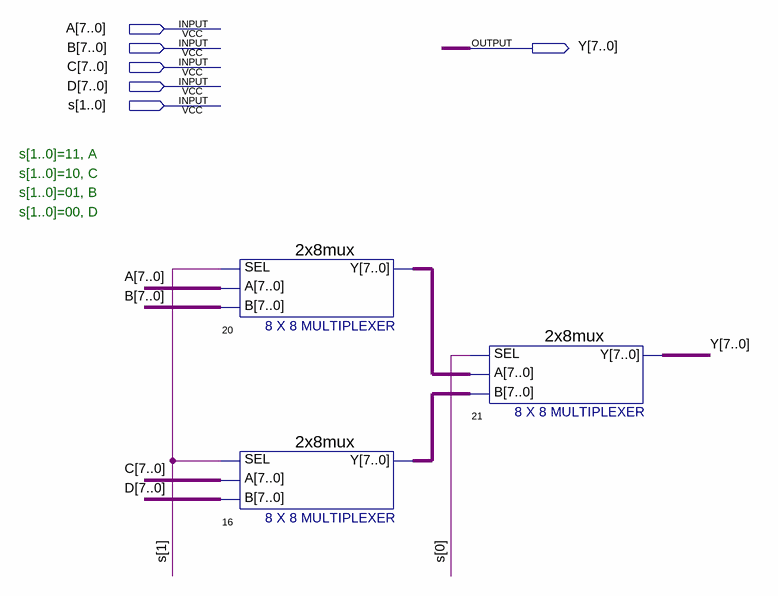
[diagram p0: schematic sheet]
// Quartus schematic 48mux.bdf as structural Verilog: 3 symbols, 6 pins
module \48mux  (
  input  [7:0] A,
  input  [7:0] B,
  input  [7:0] C,
  input  [7:0] D,
  input  [1:0] s,
  output [7:0] Y
);

  wire [7:0] n16_y, n20_y;

  \2x8mux  u_20 (.SEL(s[1]), .A(A), .B(B), .Y(n20_y));
  \2x8mux  u_16 (.SEL(s[1]), .A(C), .B(D), .Y(n16_y));
  \2x8mux  u_21 (.SEL(s[0]), .A(n20_y), .B(n16_y), .Y(Y));

  // Notes on the sheet:
  //   s[1..0]=11, A
  //   s[1..0]=10, C
  //   s[1..0]=01, B
  //   s[1..0]=00, D
endmodule
